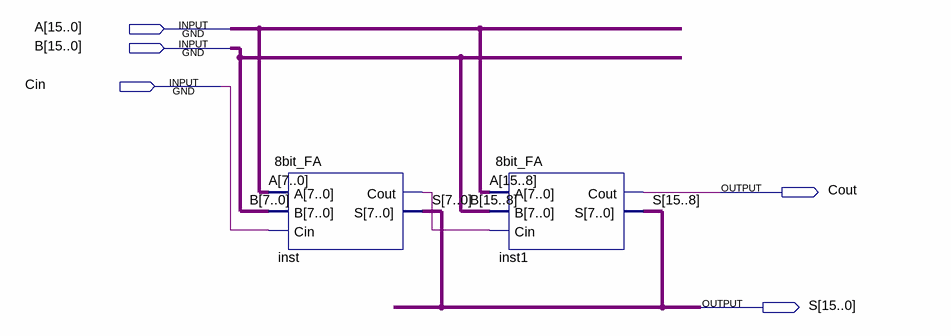
[diagram p0: schematic sheet]
// Quartus schematic 16bit_FA.bdf as structural Verilog: 2 symbols, 5 pins
module \16bit_FA  (
  input  [15:0] A,
  input  [15:0] B,
  input  Cin,
  output Cout,
  output [15:0] S
);

  wire inst_cout;

  \8bit_FA  inst (.A(A[7:0]), .B(B[7:0]), .Cin(Cin), .Cout(inst_cout), .S(S[7:0]));
  \8bit_FA  inst1 (.A(A[15:8]), .B(B[15:8]), .Cin(inst_cout), .Cout(Cout), .S(S[15:8]));
endmodule
